# EAGLE design Simon-PTH-v13 (EAGLE 5.04)
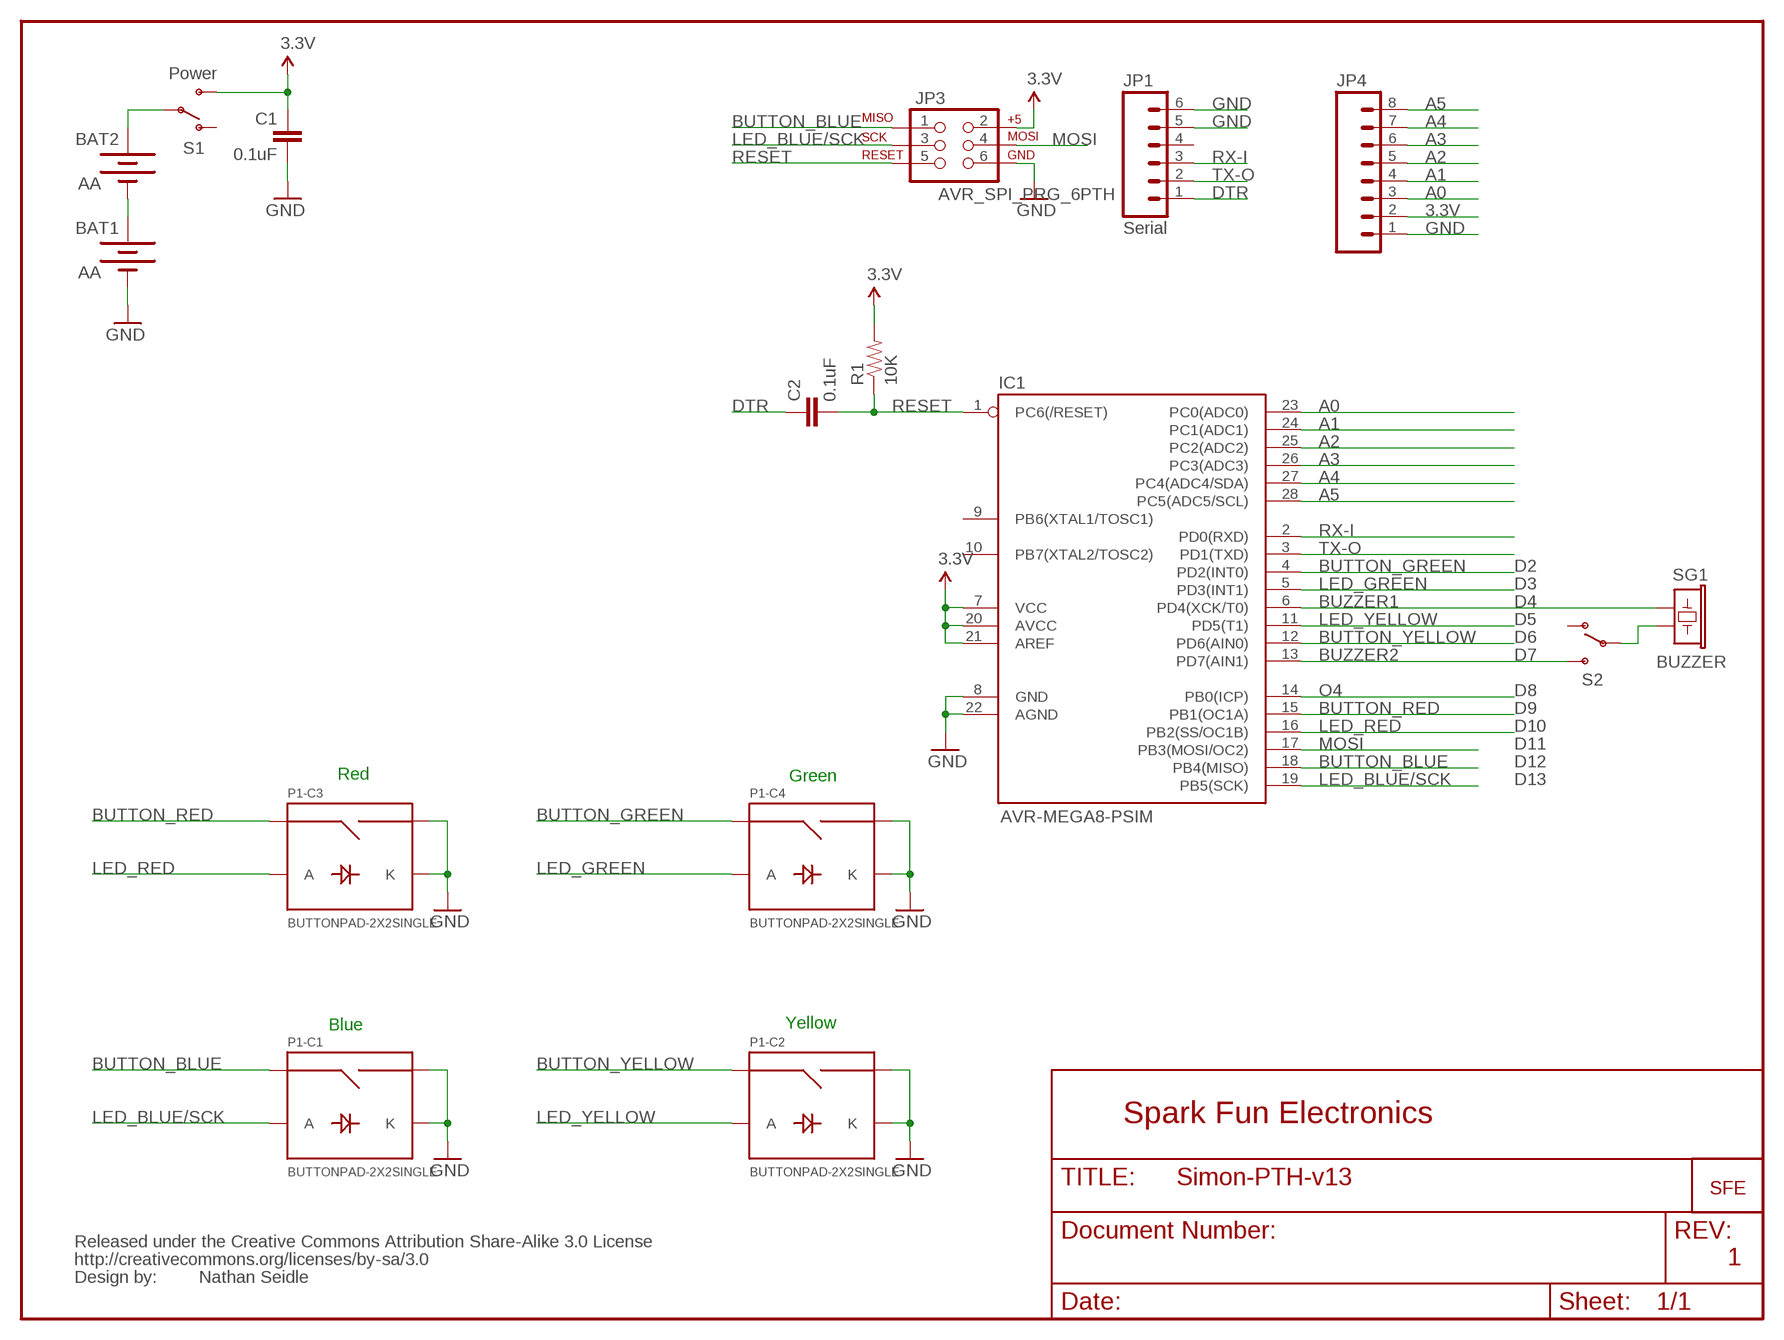
[diagram p0: schematic, sheet 1]

## Parts
BAT1  AA  BATTERYAA  [BATTERY-AA]
BAT2  AA  BATTERYAA  [BATTERY-AA]
C1  0.1uF  CAPPTH2  [CAP-PTH-SMALL2]
C2  0.1uF  CAPPTH2  [CAP-PTH-SMALL2]
IC1  AVR-MEGA8-PSIM  [DIL28-3-SIMON]
JP1  Serial  M06SIP  [1X06]
JP3  AVR_SPI_PRG_6PTH  [2X3]
JP4  M08  [1X08]
P1-  BUTTONPAD-2X2SINGLE  [BUTTONPAD-2X2SINGLE]
R1  10K  RESISTORPTH1  [AXIAL-0.3]
S1  Power  SWITCH-SPSTPTH_LOCK  [SWITCH-SPDT_LOCK.007S]
S2  SWITCH-SPSTPTH_LOCK  [SWITCH-SPDT_LOCK.007S]
SG1  BUZZER  BUZZERPTH  [BUZZER-12MM]
U$1  LOGO-SFENEW  [SFE-NEW-WEBLOGO]
U$2  CREATIVE_COMMONS  [CREATIVE_COMMONS]

## Nets
3.3V: C1.1 IC1.7(VCC) IC1.20(AVCC) IC1.21(AREF) JP3.2 JP4.2 R1.P$2 S1.3(S)
A0: IC1.23(PC0(ADC0)) JP4.3
A1: IC1.24(PC1(ADC1)) JP4.4
A2: IC1.25(PC2(ADC2)) JP4.5
A3: IC1.26(PC3(ADC3)) JP4.6
A4: IC1.27(PC4(ADC4/SDA)) JP4.7
A5: IC1.28(PC5(ADC5/SCL)) JP4.8
BUTTON_BLUE [ButtonSignal]: IC1.18(PB4(MISO)) JP3.1 P1-.SIG1(C1:SIG1)
BUTTON_GREEN: IC1.4(PD2(INT0)) P1-.SIG7(C4:SIG1)
BUTTON_RED [ButtonSignal]: IC1.15(PB1(OC1A)) P1-.SIG5(C3:SIG1)
BUTTON_YELLOW [ButtonSignal]: IC1.12(PD6(AIN0)) P1-.SIG3(C2:SIG1)
BUZZER1: IC1.6(PD4(XCK/T0)) SG1.+
BUZZER2: IC1.13(PD7(AIN1)) S2.3(S)
DTR: C2.1 JP1.1
GND: BAT1.GND@1(-) C1.2 IC1.8(GND) IC1.22(AGND) JP1.5 JP1.6 JP3.6 JP4.1 P1-.K1(C1:K) P1-.K2(C2:K) P1-.K3(C3:K) P1-.K4(C4:K) P1-.SIG2(C1:SIG2) P1-.SIG4(C2:SIG2) P1-.SIG6(C3:SIG2) P1-.SIG8(C4:SIG2)
LED_BLUE/SCK: IC1.19(PB5(SCK)) JP3.3 P1-.A1(C1:A)
LED_GREEN: IC1.5(PD3(INT1)) P1-.A4(C4:A)
LED_RED: IC1.16(PB2(SS/OC1B)) P1-.A3(C3:A)
LED_YELLOW: IC1.11(PD5(T1)) P1-.A2(C2:A)
MOSI: IC1.17(PB3(MOSI/OC2)) JP3.4
N$2: BAT2.PWR@1(+) S1.2(P)
N$3: S2.2(P) SG1.-
N$4: BAT1.PWR@1(+) BAT2.GND@1(-)
O4 [ButtonSignal]: IC1.14(PB0(ICP))
RESET: C2.2 IC1.1(PC6(/RESET)) JP3.5 R1.P$1
RX-I: IC1.2(PD0(RXD)) JP1.3
TX-O: IC1.3(PD1(TXD)) JP1.2
Unconnected: IC1.9(PB6(XTAL1/TOSC1)) IC1.10(PB7(XTAL2/TOSC2)) JP1.4 S1.1(O) S2.1(O)

## Notes on the sheet
- D2
- D3
- D4
- D5
- D6
- D7
- D8
- D9
- D10
- D11
- D12
- Red | Green
- D13
- Blue | Yellow
- Spark Fun Electronics
- 1
- Nathan Seidle

## Library data of the parts
BAT1 BAT2 = SparkFun:BATTERY: Battery Holders Various common sizes : AA, AAA, 20mm coin cell and 12mm coin cell.
C1 C2 = SparkFun:CAP: Capacitor Standard 0603 ceramic capacitor, and 0.1" leaded capacitor.
IC1 = SparkFun:AVR-MEGA8-P: MICROCONTROLLER 8 Kbytes FLASH 1 kbytes SRAM 512 bytes EEPROM USART 4-channel 10 bit ADC 2-channel 8 bit ADC
JP1 = SparkFun:M06: Header 6 Standard 6-pin 0.1" header. Use with straight break away headers (SKU : PRT-00116), right angle break away headers (PRT-00553), swiss pins (PRT-00743), machine pins (PRT-00117), and female headers (PRT-00115). Molex polarized connector foot print use with SKU : PRT-08094 with associated crimp pins and housings. NOTES ON THE VARIANTS LOCK and LOCK_LONGPADS... This footprint was designed to help hold the alignment of a through-hole component (i.e. 6-pin header) while soldering it into place. You may notice that each hole has been shifted either up or down by 0.005 of an inch from it's more standard position (which is a perfectly straight line). This slight alteration caused the pins (the squares in the middle) to touch the edges of the holes. Because they are alternating, it causes a "brace" to hold the component in place. 0.005 has proven to be the perfect amount of "off-center" position when using our standard breakaway headers. Although looks a little odd when you look at the bare footprint, once you have a header in there, the alteration is very hard to notice. Also, if you push a header all the way into place, it is covered up entirely on the bottom side. This idea of altering the position of holes to aid alignment will be further integrated into the Sparkfun Library for other footprints. It can help hold any component with 3 or more connection pins.
JP3 = SparkFun:AVR_SPI_PRG_6: AVR ISP 6 Pin This is the reduced ISP connector for AVR programming. Common on Arduino. This footprint will take up less PCB space and can be used with a 10-pin to 6-pin adapter such as SKU: BOB-08508
JP4 = SparkFun:M08: Header 8 Standard 8-pin 0.1" header. Use with straight break away headers (SKU : PRT-00116), right angle break away headers (PRT-00553), swiss pins (PRT-00743), machine pins (PRT-00117), and female headers (PRT-00115).
P1- = SparkFun:BUTTONPAD-2X2SINGLE: 5mm Button Pad Proto layout and schematic for 2x2 button pad with single color LEDs (used on Simon board). Panelize this device/fp to a 4x4 pad if needed. Any single-color 5mm LED should be compatible. Spark Fun Electronics SKU : COM-07835.
R1 = SparkFun:RESISTOR: Resistor Basic schematic elements and footprints for 0603, 1206, and PTH 1/10th watt (small) resistors.
S1 S2 = SparkFun:SWITCH-SPST: SPST Switch Simple slide switch. Spark Fun Electronics SKU : COM-00102
SG1 = SparkFun:BUZZER: Buzzer 12mm Spark Fun Electronics SKU : Comp-Buzzer
U$1 = SparkFun:LOGO-SFE: Spark Fun Electronics PCB Logo This is the standard Spark Fun Electronics PCB logo.
U$2 = SparkFun:CREATIVE_COMMONS

## Net classes
0 Default: width 0.254 mm
1 Power: width 0.254 mm
3 ButtonSignal: width 0.254 mm

## Board
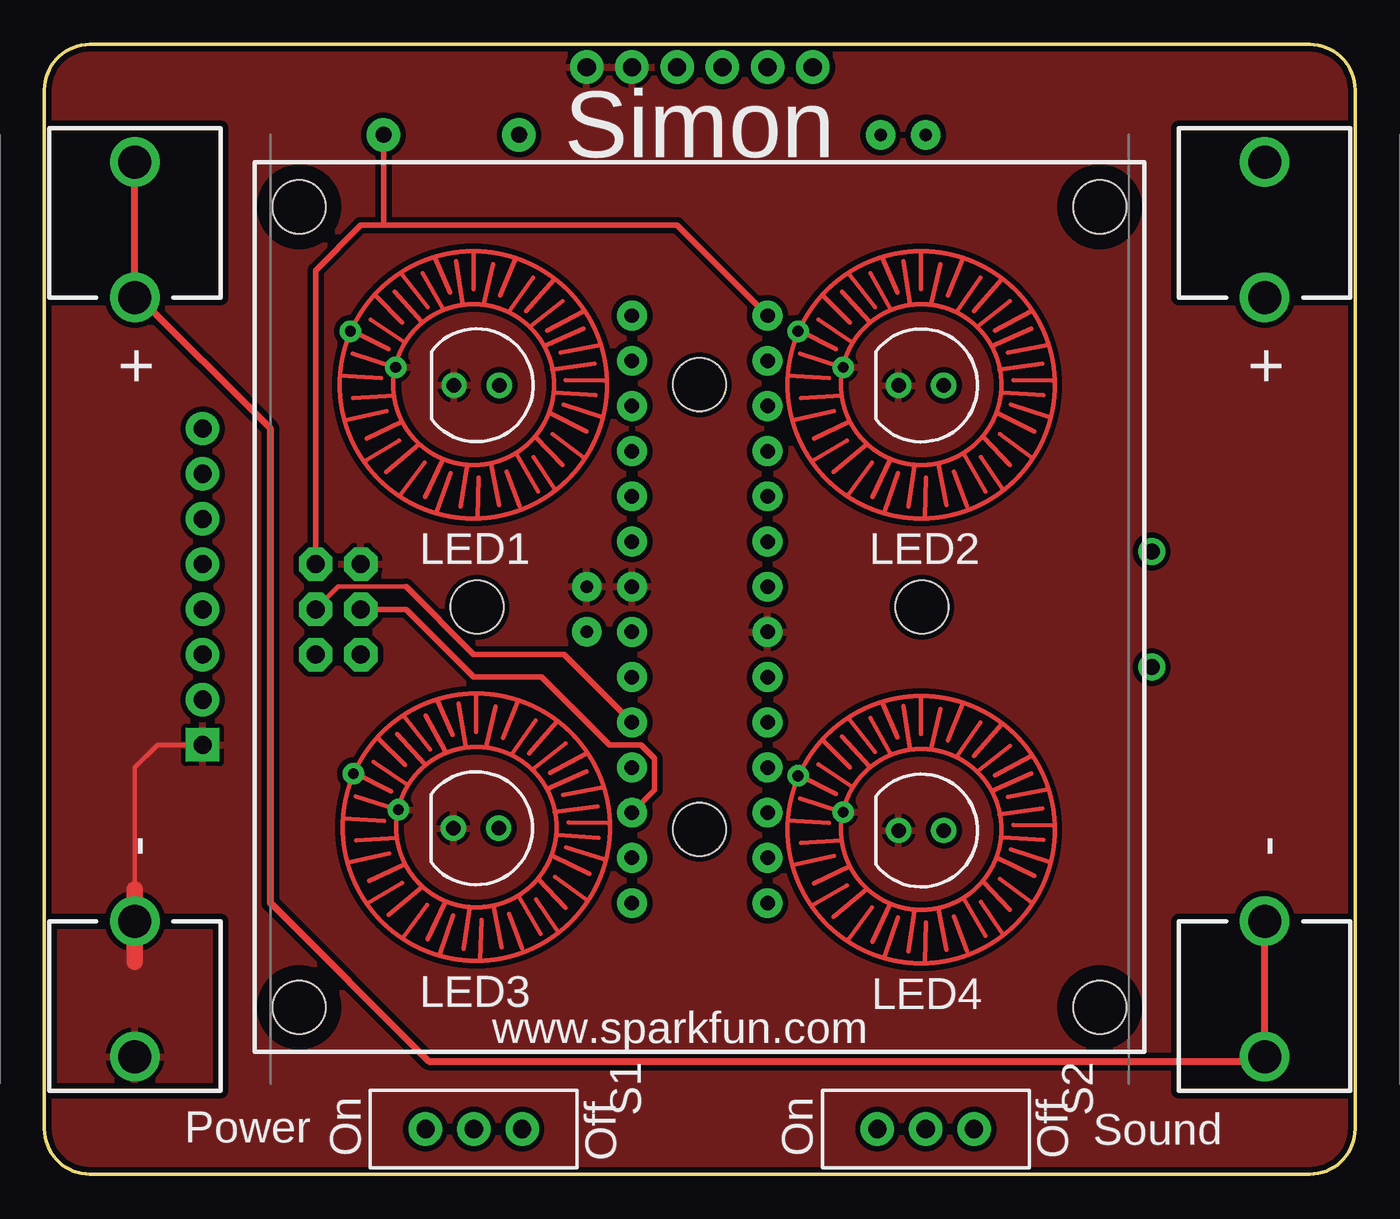
[diagram p1: board, top side]
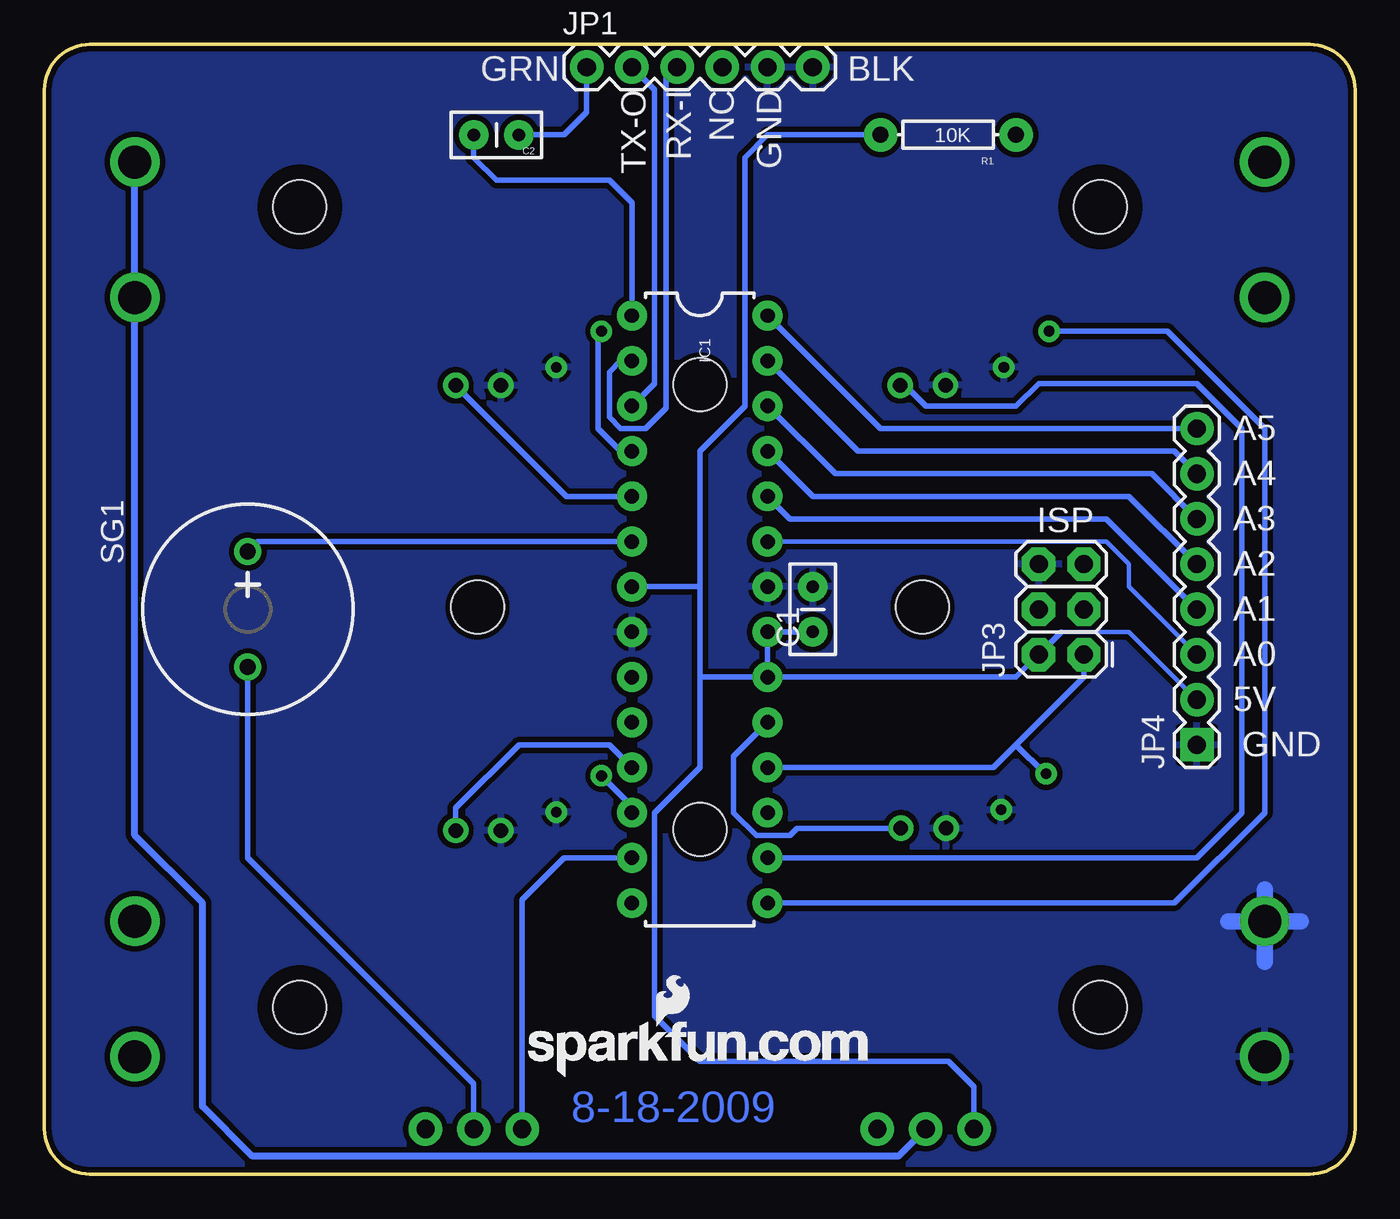
[diagram p2: board, bottom side, seen from below]

Size 73.66 x 63.5 mm. Coordinates in mm from the lower left corner, seen from the top.
Outline: 2.54,0 arc-90 0,2.54 0,60.96 arc-90 2.54,63.5 71.12,63.5 arc-90 73.66,60.96 73.66,2.54 arc-90 71.12,0 2.54,0
Copper layers (1*16): Top 0.035mm / dielectric 1.5mm / Bottom 0.035mm
Design rules "SparkFun *": minimum track width 10mil, minimum drill 20mil, track to track 8mil, track to pad 8mil, pad to pad 8mil, via to via 8mil, smd to smd 8mil, copper to edge 10mil, drill to drill 8mil, minimum pad ring 12mil, minimum via ring 10mil, stop-mask expansion 4mil, vias tented up to drill 25mil, thermal gap 10mil

### Footprints (pad centres in the part's own frame; a part is rotated, then mirrored left to right if it is on the bottom)
BATTERY-AA = drill 1.854 round: GND@1 25.146,0; GND@2 17.526,0; PWR@1 -25.146,0; PWR@2 -17.526,0
CAP-PTH-SMALL2 = drill 0.7 pad 1.651 round: 1 0,0; 2 2.54,0
DIL28-3-SIMON = drill 0.813 pad 1.676 round: 1 -16.51,-3.81; 2 -13.97,-3.81; 3 -11.43,-3.81; 4 -8.89,-3.81; 5 -6.35,-3.81; 6 -3.81,-3.81; 7 -1.27,-3.81; 8 1.27,-3.81; 9 3.81,-3.81; 10 6.35,-3.81; 11 8.89,-3.81; 12 11.43,-3.81; 13 13.97,-3.81; 14 16.51,-3.81; 15 16.51,3.81; 16 13.97,3.81; 17 11.43,3.81; 18 8.89,3.81; 19 6.35,3.81; 20 3.81,3.81; 21 1.27,3.81; 22 -1.27,3.81; 23 -3.81,3.81; 24 -6.35,3.81; 25 -8.89,3.81; 26 -11.43,3.81; 27 -13.97,3.81; 28 -16.51,3.81
1X06 = drill 1.016 pad 1.88 round: 1 0,0; 2 2.54,0; 3 5.08,0; 4 7.62,0; 5 10.16,0; 6 12.7,0
2X3 = drill 1.016 pad 1.88 octagon: 1 0,0; 2 0,2.54; 3 2.54,0; 4 2.54,2.54; 5 5.08,0; 6 5.08,2.54
1X08 = drill 1.016 pad 1.88 square: 1 0,0 | drill 1.016 pad 1.88 round: 2 2.54,0; 3 5.08,0; 4 7.62,0; 5 10.16,0; 6 12.7,0; 7 15.24,0; 8 17.78,0
BUTTONPAD-2X2SINGLE = drill 0.813 round: A1 13.716,12.573; A2 38.735,12.446; A3 13.75,37.47; A4 38.735,37.465; K1 11.176,12.573; K2 36.195,12.446; K3 11.21,37.47; K4 36.195,37.465 | drill 0.6 round: SIG1 5.542,15.64; SIG2 8.082,13.608; SIG3 30.542,15.513; SIG4 33.082,13.481; SIG5 5.388,40.513; SIG6 7.928,38.481; SIG7 30.542,40.513; SIG8 33.082,38.481 | hole 3: 12.5,25; 25,37.5; 37.5,25; 25,12.5; 2.5,2.5; 2.5,47.5; 47.5,47.5; 47.5,2.5
AXIAL-0.3 = drill 0.9 pad 1.88 round: P$1 -3.81,0; P$2 3.81,0
SWITCH-SPDT_LOCK.007S = drill 1.016 pad 1.88 round: 1 0,2.718; 2 0,0; 3 0,-2.718
BUZZER-12MM = drill 0.9 round: + 3.25,0; - -3.25,0

### Placement (x,y rotation side)
BAT1  5.08,31.75 270 top
BAT2  68.58,31.75 270 top
C1  30.48,30.48 90 bottom
C2  46.99,58.42 180 bottom
IC1  36.83,31.75 270 bottom
JP1  43.18,62.23 0 bottom
JP3  15.24,29.21 90 bottom
JP4  8.89,24.13 90 bottom
P1-  11.81,6.87 0 top
R1  22.86,58.42 180 bottom
S1  24.13,2.54 270 top
S2  49.53,2.54 270 top
SG1  62.23,31.75 90 bottom
U$1  46.48,5.46 0 bottom
U$2  16.51,-16.51 0 top  (outside the outline)

### Tracks (layer width: path | path; a pad name or v marks a point on that pad's centre or on a via)
3.3V
  Bottom 0.254: 16.51,30.48 12.7,30.48 JP4.2
  Bottom 0.305: 36.83,33.02 36.83,40.64 34.29,43.18 34.29,57.15 33.02,58.42 R1.P$2 | 36.83,33.02 IC1.7 | 36.83,27.94 36.83,22.86 39.37,20.32 39.37,8.89 36.83,6.35 22.86,6.35 21.41,4.9 S1.3 | 36.83,27.94 36.83,33.02 | 36.83,27.94 IC1.20 | IC1.20 IC1.21 C1.1 | IC1.20 19.05,27.94 JP3.2 16.51,30.48
A0
  Bottom 0.254: IC1.23 13.97,35.56 12.7,34.29 12.7,33.02 JP4.3
A1
  Bottom 0.305: JP4.4 13.97,36.83 31.75,36.83 IC1.24
A2
  Bottom 0.305: JP4.5 12.7,38.1 30.48,38.1 IC1.25
A3
  Bottom 0.305: JP4.6 11.43,39.37 29.21,39.37 IC1.26
A4
  Bottom 0.305: JP4.7 10.16,40.64 27.94,40.64 IC1.27
A5
  Bottom 0.305: IC1.28 26.67,41.91 JP4.8
BUTTON_BLUE
  Bottom 0.305: IC1.18 20.32,22.86 19.05,24.13 | 19.05,24.13 15.24,27.94 JP3.1 | P1-.SIG1 17.43,22.51 19.05,24.13
BUTTON_GREEN
  Bottom 0.305: IC1.4 41.27,40.64 42.55,41.91 42.55,47.2 P1-.SIG7
BUTTON_RED
  Bottom 0.305: IC1.15 10.16,15.24 5.08,20.32 5.08,41.91 10.56,47.39 P1-.SIG5
BUTTON_YELLOW
  Bottom 0.305: IC1.12 40.64,20.67 P1-.SIG3
BUZZER1
  Bottom 0.305: IC1.6 61.67,35.56 SG1.+
BUZZER2
  Bottom 0.305: IC1.13 44.45,17.78 46.81,15.42 S2.3
DTR
  Bottom 0.305: JP1.1 43.18,59.69 44.45,58.42 C2.1
GND
  Top 0.254: 5.08,16 5.08,22.86 6.35,24.13 JP4.1
  Top 0.914: 5.08,11.94 5.08,16
  Bottom 0.914: 3.05,14.22 7.11,14.22 | 5.08,11.94 5.08,16
  pour Bottom (isolate 0.305): 0,63.5 73.66,63.5 73.66,0 0,0
  pour Top (isolate 0.305): 0,63.5 73.66,63.5 73.66,0 0,0
LED_BLUE/SCK
  Top 0.254: 20.32,33.02 16.51,33.02 JP3.3
  Top 0.305: IC1.19 29.21,29.21 24.13,29.21 20.32,33.02
  Bottom 0.305: P1-.A1 31.35,19.45 31.75,19.05 33.66,19.05 34.92,20.32 34.92,23.5 IC1.19
LED_GREEN
  Bottom 0.305: IC1.5 44.31,38.1 P1-.A4
LED_RED
  Bottom 0.305: IC1.16 8.89,17.78 6.35,20.32 6.35,41.91 8.89,44.45 17.78,44.45 19.05,43.18 24.13,43.18 25.29,44.34 P1-.A3
LED_YELLOW
  Bottom 0.305: IC1.11 41.91,24.13 46.99,24.13 50.55,20.57 P1-.A2
MOSI
  Top 0.305: IC1.17 34.29,21.59 34.29,23.37 33.53,24.13 31.75,24.13 27.94,27.94 24.13,27.94 20.32,31.75 JP3.4
N$2
  Bottom 0.406: BAT2.PWR@1 68.58,19.05 64.77,15.24 64.77,3.81 61.98,1.02 25.65,1.02 S1.2
N$3
  Bottom 0.305: S2.2 49.53,5.08 62.23,17.78 SG1.-
N$4
  Top 0.406: BAT1.PWR@1 5.08,49.53 12.7,41.91 12.7,15.24 21.59,6.35 68.58,6.35 BAT2.GND@1 68.58,13.97
RESET
  Top 0.305: JP3.5 15.24,50.8 17.78,53.34 19.05,53.34 | IC1.1 35.56,53.34 19.05,53.34 | 19.05,53.34 R1.P$1
  Bottom 0.305: C2.2 49.53,57.15 48.26,55.88 41.91,55.88 40.64,54.61 IC1.1
RX-I
  Bottom 0.305: IC1.2 41.27,45.72 41.91,45.09 41.91,42.55 41.27,41.91 39.88,41.91 38.73,43.05 38.73,61.59 JP1.3
TX-O
  Bottom 0.305: JP1.2 39.37,60.96 39.37,44.45 IC1.3

### Text on the board
Bottom: 8-18-2009
tPlace: Simon | LED1 | LED2 | LED3 | LED4 | www.sparkfun.com | Power | Sound | On | Off | On | Off
bPlace: BLK | GRN | GND | NC | RX-I | TX-O | A5 | A4 | A3 | ISP | A2 | A1 | A0 | 5V | GND
tValues: Clips point inwards to accept AA battery | Clip | Clip | Make sure long leg goes to the round side | Top Side Components | All thru hole components make joint on bottom
bValues: Clips do not go on this side | Power Supply | 22uH | Sound | Controller | Serial | Bottom Side Components | All thru hole components make joint on top side
wert: Power Supply | LED | Controller